# Altium schematic sheet 1_Airframe-Power_1 - Old.SchDoc
size A4; SheetNumber: 2; SheetTotal: 2; SPICEModelCacheFLVJDJZP: <root> / <DocumentId>FLVJDJZP</DocumentId> / </root>
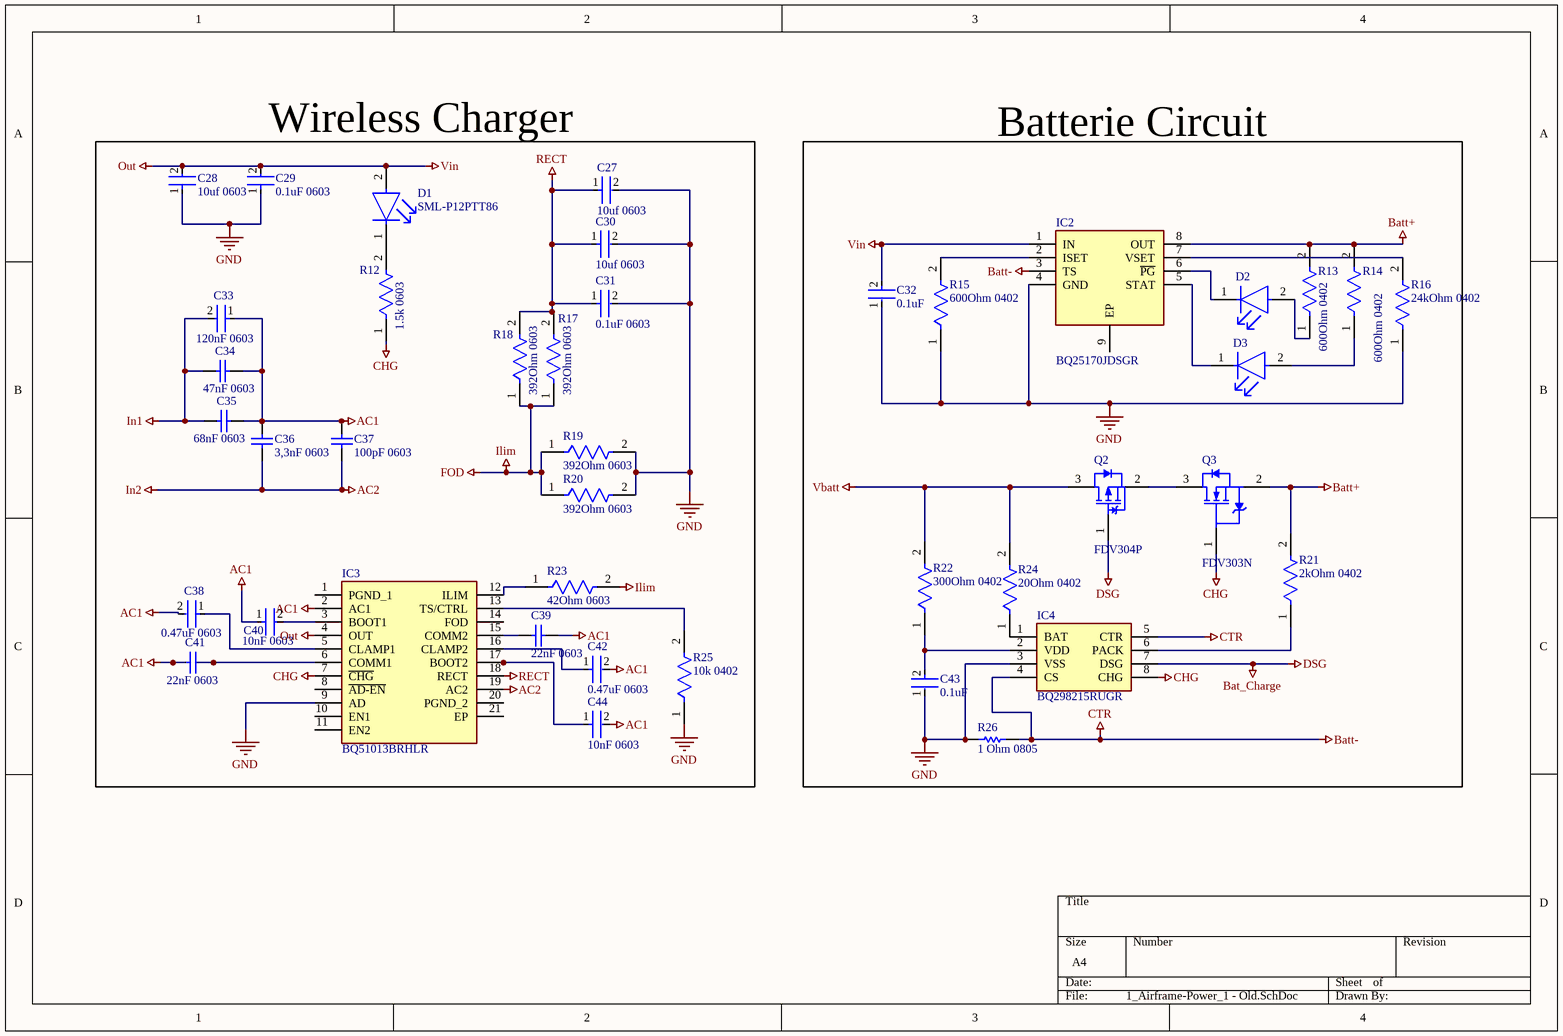
[diagram p0: 1_Airframe-Power_1 - Old.SchDoc]

## Parts
C27  10uf 0603  [FP-GRM188-0_1-e0_2_0_55-IPC_C]
C28  10uf 0603  [FP-GRM188-0_1-e0_2_0_55-IPC_C]
C29  0.1uF 0603  [FP-C0603C-CF-MFG]
C30  10uf 0603  [FP-GRM188-0_1-e0_2_0_55-IPC_C]
C31  0.1uF 0603  [FP-C0603C-CF-MFG]
C32  0.1uF  [FP-GRM15-MFG]
C33  120nF 0603  [FP-C0603C-CF-MFG]
C34  47nF 0603  [CAPC1608X90X35ML10T15]
C35  68nF 0603  [CAPC1608X90X35LL10T15]
C36  3,3nF 0603  [CAPC1608X90X35LL10T15]
C37  100pF 0603  [CAPC1608X90X35NL10T15]
C38  0.47uF 0603  [FP-GRM188-0_1-e0_2_0_5-IPC_A]
C39  22nF 0603  [CAPC1608X90X35ML10T15]
C40  10nF 0603  [FP-CC0603-DA-MFG]
C41  22nF 0603  [CAPC1608X90X35ML10T15]
C42  0.47uF 0603  [FP-GRM188-0_1-e0_2_0_5-IPC_A]
C43  0.1uF  [FP-GRM15-MFG]
C44  10nF 0603  [FP-CC0603-DA-MFG]
D1  SML-P12PTT86  [FP-SML-P1-MFG]
D2  SML-P12PTT86  [FP-SML-P1-MFG]  (value not drawn)
D3  SML-P12PTT86  [FP-SML-P1-MFG]  (value not drawn)
IC2  BQ25170JDSGR  [SON50P200X200X80-9N]
IC3  BQ51013BRHLR  [BQ51050BRHLR]
IC4  BQ298215RUGR  [BQ298215RUGR]
Q2  FDV304P  [FAIR-SOT23-3_V]
Q3  FDV303N  [FAIR-FDV303N-3_V]
R12  1.5k 0603  [FP-CRCW0402-e3-IPC_C]
R13  600Ohm 0402  [FP-CRCW0402-e3-IPC_C]
R14  600Ohm 0402  [FP-CRCW0402-e3-IPC_C]
R15  600Ohm 0402  [FP-CRCW0402-e3-IPC_C]
R16  24kOhm 0402  [FP-CRCW0402-e3-IPC_C]
R17  392Ohm 0603  [FP-CRCW0402-e3-IPC_C]
R18  392Ohm 0603  [FP-CRCW0402-e3-IPC_C]
R19  392Ohm 0603  [FP-CRCW0402-e3-IPC_C]
R20  392Ohm 0603  [FP-CRCW0402-e3-IPC_C]
R21  2kOhm 0402  [FP-CRCW0402-e3-IPC_C]
R22  300Ohm 0402  [FP-CRCW0402-e3-IPC_C]
R23  42Ohm 0603  [FP-CRCW0402-e3-IPC_C]
R24  20Ohm 0402  [FP-CRCW0402-e3-IPC_C]
R25  10k 0402  [FP-CRCW0402-e3-IPC_B]
R26  1 Ohm 0805  [RESC1609X50X30LL10T20]

## Nets
AC1: C33.1 C34.2 C35.2 C36.2 C37.2 C38.2 C39.2 C40.1 C41.2 C42.2 C44.2 IC3.2(AC1)
AC2: C36.1 C37.1 IC3.19(AC2)  [also labelled In2]
Bat_Charge: IC4.7(DSG) Q2.1(G)  [also labelled DSG]
Batt+: IC2.8(OUT) Q3.2(S) R13.2 R14.2 R21.2
Batt-: IC2.3(TS) IC4.4(CS) IC4.5(CTR) R26.2  [also labelled CTR]
CHG: IC3.7(~{CHG}) IC4.8(CHG) Q3.1(G) R12.1
FOD: R17.1 R18.1 R19.1 R20.1 R23.2  [also labelled Ilim]
GND: C27.2 C28.1 C29.1 C30.2 C31.2 C32.1 C43.1 IC2.4(GND) IC3.9(AD) IC4.3(VSS) R15.1 R16.1 R19.2 R20.2 R25.1 R26.1
In1: C33.2 C34.1 C35.1
Out: C28.2 C29.2 C32.2 D1.2(A) IC2.1(IN) IC3.4(OUT)  [also labelled Vin]
RECT: C27.1 C30.1 C31.1 IC3.18(RECT) R17.2 R18.2
Vbatt: Q2.3(D) R22.2 R24.2
NetC38_1: C38.1 IC3.5(CLAMP1)
NetC39_1: C39.1 IC3.15(COMM2)
NetC40_2: C40.2 IC3.3(BOOT1)
NetC41_1: C41.1 IC3.6(COMM1)
NetC42_1: C42.1 IC3.16(CLAMP2)
NetC43_2: C43.2 IC4.2(VDD) R22.1
NetC44_1: C44.1 IC3.17(BOOT2)
NetD1_1: D1.1(C) R12.2
NetD2_1: D2.1(C) IC2.6(~{PG})
NetD2_2: D2.2(A) R13.1
NetD3_1: D3.1(C) IC2.5(STAT)
NetD3_2: D3.2(A) R14.1
NetIC2_2: IC2.2(ISET) R15.2
NetIC2_7: IC2.7(VSET) R16.2
NetIC3_12: IC3.12(ILIM) R23.1
NetIC3_13: IC3.13(TS/CTRL) R25.2
NetIC4_1: IC4.1(BAT) R24.1
NetIC4_6: IC4.6(PACK) R21.1
NetQ2_2: Q2.2(S) Q3.3(D)

Not connected (* = marked no-connect by the designer): IC2 9(EP); IC3 1(PGND_1) 8(~{AD-EN}) 10(EN1) 11(EN2) 14(FOD) 20(PGND_2) 21(EP)

## Notes on the sheet
- Wireless Charger
- Batterie Circuit

## Library data of the parts
C27 C28 C30 = CMP-2006-02792-2: Chip Multilayer Ceramic Capacitors for General Purpose, 0603, 10uF, X5R, 15%, 20%, 6.3V; Packaging: Tape and Reel; Voltage Rating (DC): 6.3V; Width: 0.031inch; Termination: SMD/SMT; Dielectric: X5R; Package Quantity: 4000; Voltage Rating: 6.3V; Capacitance: 10uF; Case/Package: 0603; Min Operating Temperature: -55°C; Voltage: 6.3V; Length: 1.6mm; Thickness: 0.035inch; Lead Free: Lead Free; Depth: 0.8mm; Case Code (Imperial): 0603; Max Operating Temperature: 85°C; Material: Ceramic; Height: 0.8mm; Tolerance: 20%; Mount: Surface Mount; REACH SVHC: No SVHC; Radiation Hardening: No; Case Code (Metric): 1608
C29 C31 = CMP-2006-03061-2: CAP CER 0.1UF 50V X7R 0603; Manufacturer: KEMET; Manufacturer Part Number: C0603C104K5RACTU; Tolerance: 0.1; Temperature Coefficient: 30ppm/°C; Material: Ceramic; Automotive Grade: Grade 1; Value: 0.10 μF; Temperature: -55°C to +125°C; RoHS: TRUE; Temperature Range High: +125°C; Lead Free: Yes; Octopart: https://octopart.com/c0603c104k5ractu-kemet-139244; Digikey Description: CAP CER 0.1UF 50V X7R 0603; Category: Cap; Package: C0603C-CF; ComponentLink2Description: Datasheet; Temperature Range Low: -55°C; Device Class L1: Passive Components; Voltage Rating: 50 V; Automotive: Yes; Device Class L3: Ceramic Capacitors; ComponentLink2URL: https://api.kemet.com/component-edge/download/datasheet/C0603C100J5GACAUTO.pdf; Capacitance: 0.10 μF; Device Class L2: Capacitors; Temperature Characteristic: X7R; Height: 0.87mm
C32 C43 = CMP-2100-03641-2: CAP CER 0.1UF 16V X7R 0402; Manufacturer Part Number: GRM155R71C104KA88D; Manufacturer: Murata; Standoff Height: 0mm; Tolerance: 10%; Voltage Rating: 16Vdc; Material: Ceramic; Capacitance: 0.10μF; Value: 0.10μF; RoHS: TRUE; Temperature Characteristic: X7R; Octopart: https://octopart.com/grm155r71c104ka88d-murata-196880; Digikey Description: CAP CER 0.1UF 16V X7R 0402; Device Class L3: Ceramic Capacitors; Height: 0.55mm; ComponentLink2Description: Datasheet; Temperature Range Low: -55°C; Ipc Land Pattern Name: CAPC10050X219; ComponentLink2URL: https://search.murata.co.jp/Ceramy/image/img/A01X/G101/ENG/GRM155R71H471KA01-01A.pdf; Device Class L1: Passive Components; Lead Free: yes; Category: Cap; Package: GRM15; Temperature: -55°C to +125°C; Device Class L2: Capacitors; Temperature Range High: +125°C; Mouser Description: 0402 0.1 uF 16V ±10 % Tolerance X7R SMT Multilayer Ceramic Capacitor
C33 = CMP-1035-02605-3: 0603 C 120nF Ceramic Multilayer Capacitor; 50 V; +125degC; X7R Dielec; +/-10%; Manufacturer: KEMET; Manufacturer Part Number: C0603C124K5RACTU; Capacitance: 0.12 μF; Automotive Grade: Grade 1; Voltage Rating: 50 V; Tolerance: 0.1; Temperature Coefficient: 30ppm/°C; Value: 0.12 μF; Device Class L2: Capacitors; Package: C0603C-CF; Digikey Description: 0603 C 120nF Ceramic Multilayer Capacitor; 50 V; +125degC; X7R Dielec; +/-10%; Device Class L3: Ceramic Capacitors; Category: Cap; Material: Ceramic; Height: 0.87mm; Temperature: -55°C to +125°C; Temperature Range High: +125°C; Temperature Characteristic: X7R; Lead Free: Yes; Automotive: Yes; ComponentLink2URL: https://api.kemet.com/component-edge/download/datasheet/C0603C100J5GACAUTO.pdf; Octopart: https://octopart.com/c0603c124k5ractu-kemet-12818104; Device Class L1: Passive Components; RoHS: TRUE; ComponentLink2Description: Datasheet; Temperature Range Low: -55°C
C34 = CMP-2006-02927-1: Manufacturer: Murata; Part Number: GRM188R71H473KA61D
C35 = CMP-2006-02937-1: Part Number: GRM188R71H683KA93D; Manufacturer: Murata
C36 = CMP-2006-02916-1: Manufacturer: Murata; Part Number: GRM188R71H332KA01D
C37 = CMP-2006-02595-1: Part Number: GRM1885C1H101JA01D; Manufacturer: Murata
C38 C42 = CMP-2006-02860-2: Chip Multilayer Ceramic Capacitors for General Purpose, 0603, 0.47uF, X7R, 15%, 10%, 16V; Capacitance: 470nF; Material: Ceramic; Termination: SMD/SMT; Case Code (Imperial): 0603; Height: 0.8mm; Dielectric: X7R; Length: 1.6mm; Packaging: Tape and Reel; Mount: Surface Mount; Thickness: 0.035inch; Voltage Rating (DC): 16V; Case Code (Metric): 1608; REACH SVHC: No SVHC; Depth: 0.8mm; Number of Pins: 2; Max Operating Temperature: 125°C; Min Operating Temperature: -55°C; Width: 0.8mm; Voltage: 16V; Lead Free: Lead Free; Voltage Rating: 16V; Package Quantity: 1; Case/Package: 0603; Tolerance: 10%
C39 C41 = CMP-2006-02910-1: Manufacturer: Murata; Part Number: GRM188R71H223KA01D
C40 C44 = CMP-2100-03600-2: CAP CER 10000PF 50V X7R 0603; Manufacturer Part Number: CC0603KRX7R9BB103; Manufacturer: YAGEO; Tolerance: 0.1; Material: Ceramic; Temperature Coefficient: 15%; Mouser Description: Multilayer Ceramic Capacitor, CC Series, 0.01 - F, - 10%, X7R, 50 V, 0603 [1608 Metric]; Digikey Description: CAP CER 10000PF 50V X7R 0603; Height: 0.9mm; Category: Cap; Temperature Characteristic: X7R; Footprint Url: http://www.yageo.com/exep/pages/download/literatures/UPY-C_GEN_24.pdf; Lead Free: Yes; Voltage Rating: 50 V; Temperature: -55°C to +125°C; Device Class L3: Ceramic Capacitors; ComponentLink2Description: Datasheet; Voltage: 50 V; Package: CC0603-DA; Octopart: https://octopart.com/cc0603krx7r9bb103-yageo-192938; Automotive: No; Temperature Range High: +125°C; Temperature Range Low: -55°C; Value: 10 nF; RoHS: TRUE; Device Class L1: Passive Components; ComponentLink2URL: http://www.yageo.com/documents/recent/UPY-GPHC_X7R_6.3V-to-50V_18.pdf; Device Class L2: Capacitors; Capacitance: 10 nF
D1-D3 = CMP-08952-000020-1: LED GREEN CLEAR 1006 SMD; Manufacturer: Rohm; Led Orientation: Top View; Wavelength: 560nm; Forward Current: 20mA; Reverse Voltage: 5V; Power Dissipation: 52mW; Forward Voltage: 2.1V; Luminous Intensity: 10mcd; Device Class L1: Optoelectronics; Digikey Description: LED GREEN CLEAR 1006 SMD; Lead Free: Yes; Manufacturer Part Number: SML-P12PTT86; Temperature Range High: +85°C; Octopart: https://octopart.com/sml-p12ptt86-rohm-9290705; Device Class L2: LEDs; Colour: Green; RoHS: TRUE; Height: 0.25mm; Automotive: No; Device Class L3: unset; Temperature Range Low: -40°C; ComponentLink2Description: Datasheet; Mouser Description: Standard LEDs - SMD SMD Green 13 mcd height=0.2; Category: Diode; ComponentLink2URL: https://www.rohm.com/datasheet/SML-P12DT(R); Temperature: -40°C to +85°C; Package: SML-P1
IC2 = BQ25170JDSGR: Integrated Circuit; Manufacturer_Name: Texas Instruments; Datasheet Link: https://www.ti.com/lit/ds/symlink/bq25170j.pdf?ts=1649696800811&ref_url=https%253A%252F%252Fwww.ti.com%252Fproduct%252FBQ25170J; Height: 0.8mm; Manufacturer_Part_Number: BQ25170JDSGR; Mouser Part Number: 595-BQ25170JDSGR; Mouser Price/Stock: https://www.mouser.co.uk/ProductDetail/Texas-Instruments/BQ25170JDSGR?qs=A6eO%252BMLsxmRHugWPcRNj7A%3D%3D; Arrow Part Number: BQ25170JDSGR; Arrow Price/Stock: https://www.arrow.com/en/products/bq25170jdsgr/texas-instruments?region=nac
IC3 = BQ51013BRHLR: Integrated Circuit; Manufacturer_Name: Texas Instruments; Datasheet Link: http://www.ti.com/lit/ds/symlink/bq51013b.pdf; Manufacturer_Part_Number: BQ51013BRHLR; Mouser Part Number: 595-BQ51013BRHLR; Mouser Price/Stock: https://www.mouser.co.uk/ProductDetail/Texas-Instruments/BQ51013BRHLR?qs=y1vSg4rOnUJlN8ZPg6D5Pw%3D%3D; Arrow Part Number: BQ51013BRHLR; Arrow Price/Stock: https://www.arrow.com/en/products/bq51013brhlr/texas-instruments?region=nac
IC4 = BQ298215RUGR: Integrated Circuit; Manufacturer_Name: Texas Instruments; Datasheet Link: https://www.arrow.com/en/products/bq298215rugr/texas-instruments?region=nac; Height: 0.4mm; Manufacturer_Part_Number: BQ298215RUGR; Mouser Part Number: 595-BQ298215RUGR; Mouser Price/Stock: https://www.mouser.co.uk/ProductDetail/Texas-Instruments/BQ298215RUGR?qs=iLbezkQI%252Bsg5V9tasAPYiQ%3D%3D; Arrow Part Number: BQ298215RUGR; Arrow Price/Stock: https://www.arrow.com/en/products/bq298215rugr/texas-instruments?region=nac
Q2 = CMP-2000-06263-1: P-Channel Digital FET, -25 V, -0.46 A, 0.35 W, -55 to 150 degC, 3-Pin SOT-23, -55 to 150 degC, RoHS, Tape and Reel; Manufacturer: FairchildSemiconductor; Rad Hard: No; Typical Fall Time: 35ns; Typical Rise Time: 8ns; Channel Mode: Enhancement; Maximum Continuous Drain Current: 0.46A; RDS-on: 1100@4.5VmOhm; Maximum Drain Source Voltage: 25V; Package Version: Rev. 12, 03/2016; Typical Turn-On Delay Time: 6ns; Maximum Gate Source Voltage: 8V; Channel Type: P; Typical Turn-Off Delay Time: 55ns; Datasheet Version: Rev. E1, 08/1997; Package Description: 3-Pin Small Outline Transistor, Body 2.92 x 1.325 mm, Pitch 0.95 mm; Operating Temperature: -55to150°C; Package Reference: SOT23-3; Manufacturer URL: https://www.fairchildsemi.com/; Package URL: http://www.fairchildsemi.com/dwg/MA/MA03D.pdf; Package: 3SOT-23; Category: MOSFET; Packaging: Tape&Reel; Mounting: SurfaceMount; Datasheet URL: https://www.fairchildsemi.com/datasheets/FD/FDV304P.pdf; Mounting Technology: SurfaceMount
Q3 = CMP-2000-05111-1: N-Channel MOSFET Transistor, 8 V VGSS, 25 V VDSS, 0.68 A, -55 to 150 degC, 3-Pin SOT23, RoHS, Tape and Reel; Manufacturer: Fairchild; Typical Turn-On Delay Time: 3ns; Channel Mode: Enhancement; RDS-on: 450@4.5VmOhm; Maximum Continuous Drain Current: 0.68A; Maximum Drain Source Voltage: 25V; Rad Hard: No; Typical Fall Time: 13ns; Channel Type: N; Typical Turn-Off Delay Time: 17ns; Maximum Gate Source Voltage: 8V; Typical Rise Time: 8.5ns; Mounting: SurfaceMount; Packaging: Tape&Reel; Manufacturer URL: https://www.fairchildsemi.com/; Datasheet URL: https://datasheet.ciiva.com/22681/1845307-22681736.pdf; Package: 3SOT-23; Category: MOSFET; Operating Temperature: -55to150degC; Datasheet Version: Rev. D2, 07/2014
R12 R17-R20 R23 = CMP-2002-08122-2: RES Thick Film, 0Ω, 0.063W, 0402; Tolerance: 5%; Max Power Dissipation: 63mW; Voltage Rating: 50V; Temperature Coefficient: 100ppm/°C; Resistance: 0mR; Contact Plating: Tin; Height: 0.35mm; Radiation Hardening: No; Features: Automotive AEC-Q200; Composition: Thick Film; Width: 0.5mm; Weight: 2.3E-05oz; Termination: SMD/SMT; Packaging: Tape and Reel; Mount: Surface Mount; Case Code (Metric): 1005; Military Standard: Not; Min Operating Temperature: -55°C; Number of Terminations: 2; Package Quantity: 1; Case Code (Imperial): 0402; Depth: 0.5mm; Max Operating Temperature: 155°C; Case/Package: 0402; Power Rating: 63mW; Lead Free: Lead Free; Voltage Rating (DC): 50V; Length: 1mm
R13-R16 R21 R22 R24 = CMP-2002-08359-2: RES Thick Film, 20Ω, 1%, 0.063W, 100ppm/°C, 0402; Resistance: 20R; Voltage Rating: 50V; Max Power Dissipation: 63mW; Mount: Surface Mount; Packaging: Tape and Reel; Military Standard: Not; Height: 0.35mm; Depth: 0.5mm; Lead Free: Lead Free; Number of Terminations: 2; Contact Plating: Tin; Max Operating Temperature: 155°C; Package Quantity: 10; Termination: SMD/SMT; Min Operating Temperature: -55°C; Features: Automotive AEC-Q200; Radiation Hardening: No; Case Code (Metric): 1005; Width: 0.02inch; Composition: Thick Film; Case/Package: 0402; Case Code (Imperial): 0402; Temperature Coefficient: 100ppm/°C; Tolerance: 1%; Power Rating: 63mW; Voltage Rating (DC): 50V; Length: 1mm; Weight: 2.3E-05oz
R25 = CMP-2002-08135-2: RES SMD 10K OHM 1% 1/16W 0402; Power Rating: 63mW; Resistance: 10kR; Voltage Rating: 50V; Temperature Coefficient: 100ppm/°C; Case Code (Metric): 1005; Features: Automotive AEC-Q200; Termination: SMD/SMT; Mount: Surface Mount; Package Quantity: 10; Packaging: Tape and Reel; Case Code (Imperial): 0402; Weight: 2.3E-05oz; Lead Free: Lead Free; Width: 0.02inch; Max Power Dissipation: 63mW; Tolerance: 1%; Number of Terminations: 2; Height: 0.35mm; Number of Pins: 2; Composition: Thick Film; Length: 1mm; Voltage Rating (DC): 50V; Case/Package: 0402; Radiation Hardening: No; Contact Plating: Tin; Depth: 0.5mm; Military Standard: Not; Min Operating Temperature: -55°C; Max Operating Temperature: 155°C
R26 = CMP-1012-00171-2: Manufacturer: Vishay Dale; Part Number: CRCW06031R00FKEA